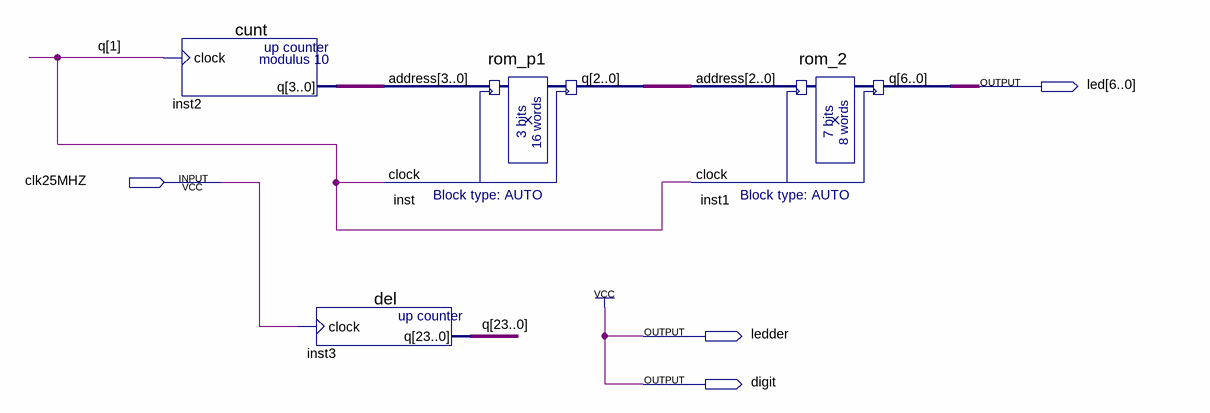
[diagram p0: schematic sheet]
// Quartus schematic La_uftwafla.bdf as structural Verilog: 4 symbols, 4 pins
module La_uftwafla (
  input  clk25MHZ,
  output [6:0] led,
  output ledder,
  output digit
);

  wire [2:0] inst_q;
  wire [3:0] inst2_q;
  wire [23:0] q;

  cunt inst2 (.clock(q[1]), .q(inst2_q));
  del inst3 (.clock(clk25MHZ), .q(q));
  rom_p1 inst (.address(inst2_q), .clock(q[1]), .q(inst_q));
  rom_2 inst1 (.address(inst_q), .clock(q[1]), .q(led));

  assign digit = 1'b1;
  assign ledder = 1'b1;
endmodule
